# EAGLE design dboard (EAGLE 4.16)
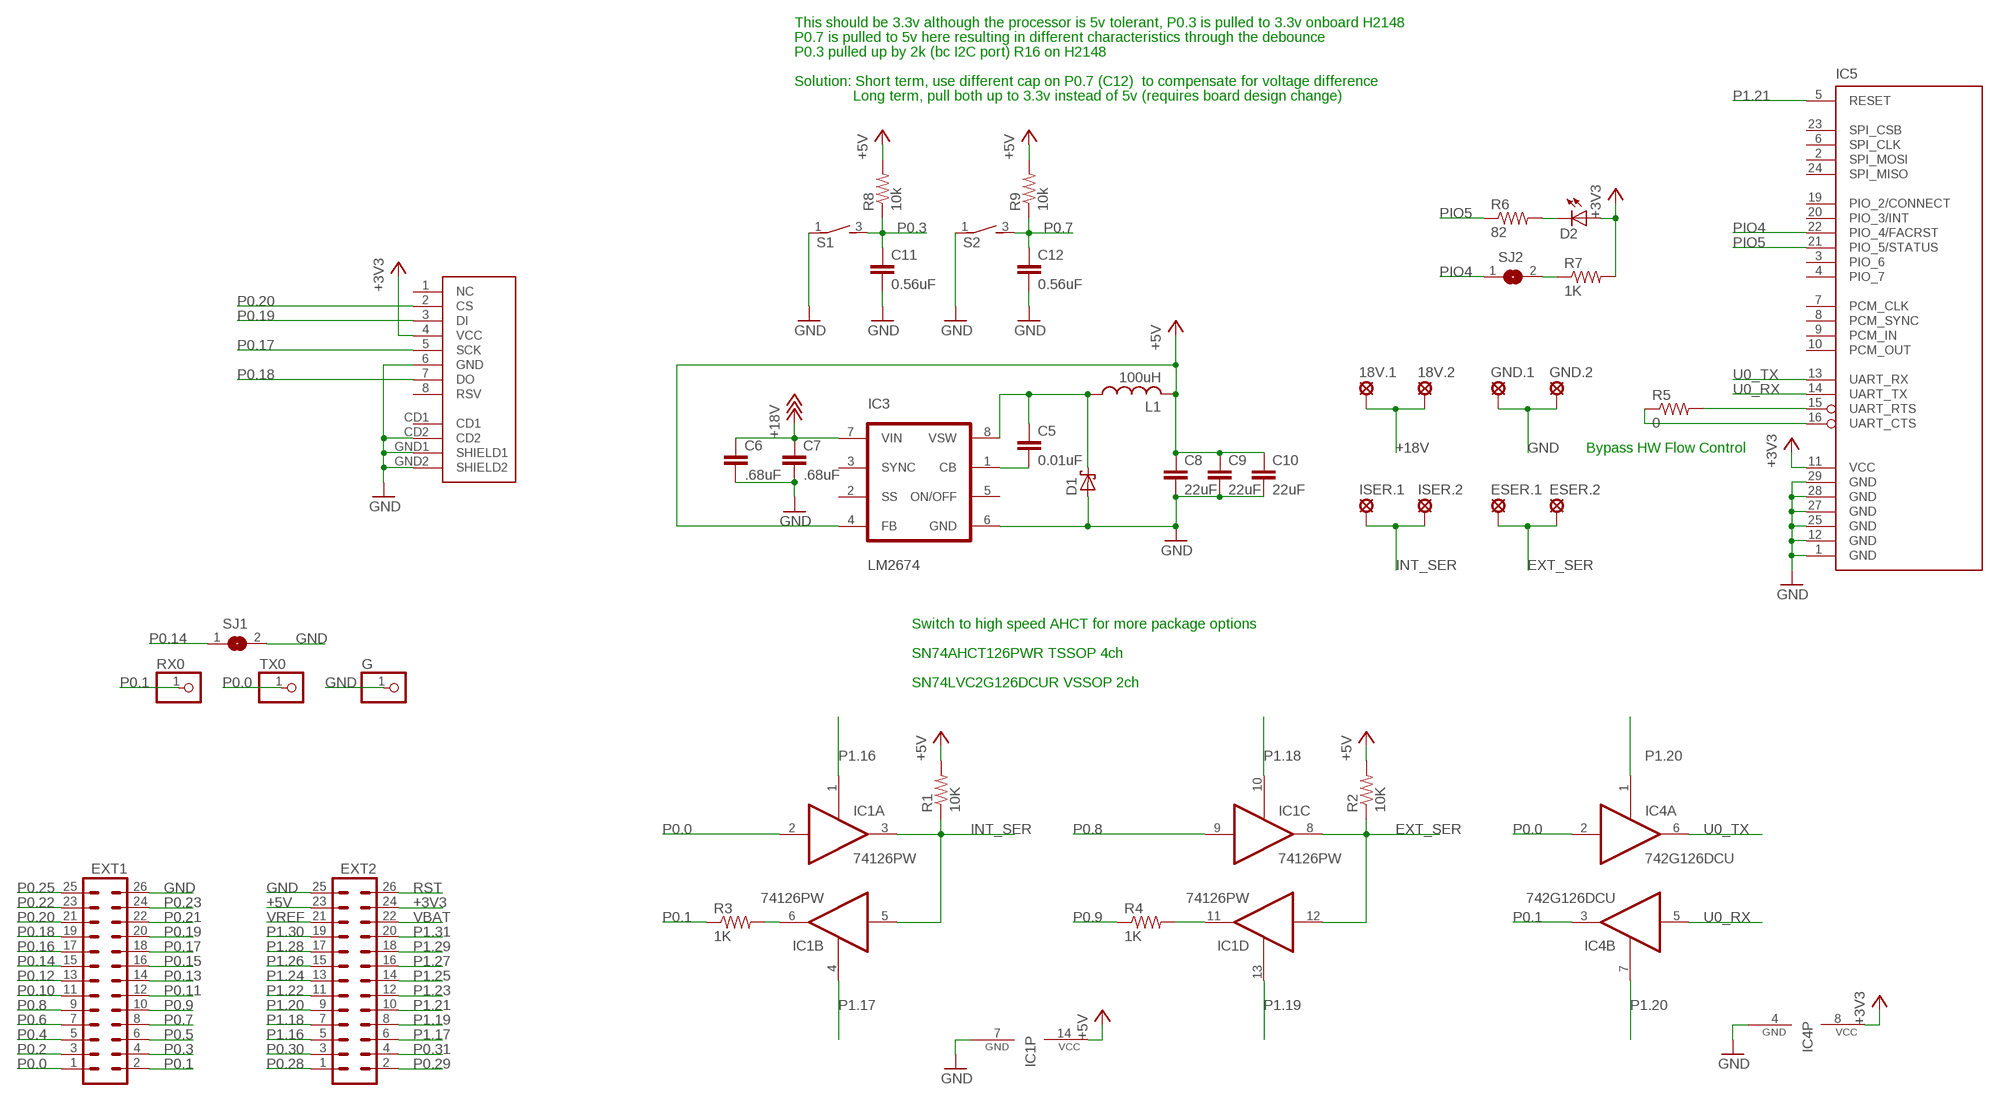
[diagram p0: schematic, sheet 1]

## Parts
18V.1  MCS10B20B  [MCS20B]
18V.2  MCS10B20B  [MCS20B]
C5  0.01uF  C-EUC0603K  [C0603K]
C6  .68uF  C-EUC1210  [C1210]
C7  .68uF  C-EUC1210  [C1210]
C8  22uF  C-EUC1210  [C1210]
C9  22uF  C-EUC1210  [C1210]
C10  22uF  C-EUC1210  [C1210]
C11  0.56uF  C-EUC0603  [C0603]
C12  0.56uF  C-EUC0603  [C0603]
D1  SCHOTTKY-DIODEDO214AA  [DO214AA]
D2  LEDCHIPLED_0603  [CHIPLED_0603]
ESER.1  MCS10B20B  [MCS20B]
ESER.2  MCS10B20B  [MCS20B]
EXT1  ML26ML26R  [ML26R]
EXT2  ML26ML26R  [ML26R]
G  PINHD-1X1  [1X01]
GND.1  MCS10B20B  [MCS20B]
GND.2  MCS10B20B  [MCS20B]
IC1  74126PW  [TSSOP14]
IC3  LM2674  [SO8]
IC4  742G126DCU  [VSSOP8]
IC5  BLUERADIO_BR-C40ABAS  [BLUERADIO_BR-C40A]
ISER.1  MCS10B20B  [MCS20B]
ISER.2  MCS10B20B  [MCS20B]
L1  100uH  L-USDR74  [DR74]
R1  10K  R-US_R0603  [R0603]
R2  10K  R-US_R0603  [R0603]
R3  1K  R-US_R0603  [R0603]
R4  1K  R-US_R0603  [R0603]
R5  0  R-US_R0603  [R0603]
R6  82  R-US_R0603  [R0603]
R7  1K  R-US_R0603  [R0603]
R8  10k  R-US_R0603  [R0603]
R9  10k  R-US_R0603  [R0603]
RX0  PINHD-1X1  [1X01]
S1  GP11MSV1BE  [GP12MSV1BE]
S2  GP11MSV1BE  [GP12MSV1BE]
SJ1  SJ  [SJ]
SJ2  SJ  [SJ]
SKT1  USD-SOCKETUSD  [USD-SOCKET-PP]
TX0  PINHD-1X1  [1X01]

## Nets
+3V3: D2.A EXT2.24 IC4.8(P:VCC) IC5.11(VCC) R7.2 SKT1.4(VCC)
+5V: C8.1 C9.1 C10.1 EXT2.23 IC1.14(P:VCC) IC3.4(FB) L1.P$2 R1.2 R2.2 R8.2 R9.2
+18V: 18V.1.MP 18V.2.MP C6.1 C7.1 IC3.7(VIN)
EXT_SER: ESER.1.MP ESER.2.MP IC1.8(C:O) IC1.12(D:I) R2.1
GND: C6.2 C7.2 C8.2 C9.2 C10.2 C11.2 C12.2 D1.A EXT1.26 EXT2.25 G.1 GND.1.MP GND.2.MP IC1.7(P:GND) IC3.6(GND) IC4.4(P:GND) IC5.1(GND) IC5.12(GND) IC5.25(GND) IC5.27(GND) IC5.28(GND) IC5.29(GND) S1.1(P) S2.1(P) SJ1.2 SKT1.6(GND) SKT1.CD2 SKT1.GND1(SHIELD1) SKT1.GND2(SHIELD2)
INT_SER: IC1.3(A:O) IC1.5(B:I) ISER.1.MP ISER.2.MP R1.1
N$1: C5.2 IC3.1(CB)
N$2: IC1.11(D:O) R4.2
N$3: C5.1 D1.C IC3.8(VSW) L1.P$1
N$4: IC1.6(B:O) R3.2
N$5: IC5.15(UART_RTS) R5.2
N$6: IC5.16(UART_CTS) R5.1
N$7: D2.C R6.2
N$8: R7.1 SJ2.2
P0.0: EXT1.1 IC1.2(A:I) IC4.2(A:I) TX0.1
P0.1: EXT1.2 IC4.3(B:O) R3.1 RX0.1
P0.2: EXT1.3
P0.3: C11.1 EXT1.4 R8.1 S1.3(S)
P0.4: EXT1.5
P0.5: EXT1.6
P0.6: EXT1.7
P0.7: C12.1 EXT1.8 R9.1 S2.3(S)
P0.8: EXT1.9 IC1.9(C:I)
P0.9: EXT1.10 R4.1
P0.10: EXT1.11
P0.11: EXT1.12
P0.12: EXT1.13
P0.13: EXT1.14
P0.14: EXT1.15 SJ1.1
P0.15: EXT1.16
P0.16: EXT1.17
P0.17: EXT1.18 SKT1.5(SCK)
P0.18: EXT1.19 SKT1.7(DO)
P0.19: EXT1.20 SKT1.3(DI)
P0.20: EXT1.21 SKT1.2(CS)
P0.21: EXT1.22
P0.22: EXT1.23
P0.23: EXT1.24
P0.25: EXT1.25
P0.28: EXT2.1
P0.29: EXT2.2
P0.30: EXT2.3
P0.31: EXT2.4
P1.16: EXT2.5 IC1.1(A:OE)
P1.17: EXT2.6 IC1.4(B:OE)
P1.18: EXT2.7 IC1.10(C:OE)
P1.19: EXT2.8 IC1.13(D:OE)
P1.20: EXT2.9 IC4.1(A:OE) IC4.7(B:OE)
P1.21: EXT2.10 IC5.5(RESET)
P1.22: EXT2.11
P1.23: EXT2.12
P1.24: EXT2.13
P1.25: EXT2.14
P1.26: EXT2.15
P1.27: EXT2.16
P1.28: EXT2.17
P1.29: EXT2.18
P1.30: EXT2.19
P1.31: EXT2.20
PIO4: IC5.22(PIO_4/FACRST) SJ2.1
PIO5: IC5.21(PIO_5/STATUS) R6.1
RST: EXT2.26
U0_RX: IC4.5(B:I) IC5.14(UART_TX)
U0_TX: IC4.6(A:O) IC5.13(UART_RX)
VBAT: EXT2.22
VREF: EXT2.21
Unconnected: IC3.2(SS) IC3.3(SYNC) IC3.5(ON/OFF) IC5.2(SPI_MOSI) IC5.3(PIO_6) IC5.4(PIO_7) IC5.6(SPI_CLK) IC5.7(PCM_CLK) IC5.8(PCM_SYNC) IC5.9(PCM_IN) IC5.10(PCM_OUT) IC5.19(PIO_2/CONNECT) IC5.20(PIO_3/INT) IC5.23(SPI_CSB) IC5.24(SPI_MISO) SKT1.1(NC) SKT1.8(RSV) SKT1.CD1

## Notes on the sheet
- This should be 3.3v although the processor is 5v tolerant, P0.3 is pulled to 3.3v onboard H2148
- P0.7 is pulled to 5v here resulting in different characteristics through the debounce
- P0.3 pulled up by 2k (bc I2C port) R16 on H2148
- Solution: Short term, use different cap on P0.7 (C12)  to compensate for voltage difference
- Long term, pull both up to 3.3v instead of 5v (requires board design change)
- Bypass HW Flow Control
- Switch to high speed AHCT for more package options
- SN74AHCT126PWR TSSOP 4ch
- SN74LVC2G126DCUR VSSOP 2ch

## Library data of the parts
18V.1 18V.2 ESER.1 ESER.2 GND.1 GND.2 ISER.1 ISER.2 = solpad:MCS10B: SOLDER PAD MC S1, distributor Buerklin, 15F505
C5-C12 = rcl:C-EU: CAPACITOR, European symbol
D1 = diode:SCHOTTKY-DIODE: Schottky Diode
D2 = led:LED: LED OSRAM: - CHIPLED LG R971, LG N971, LY N971, LG Q971, LY Q971, LO R971, LY R971 LH N974, LH R974 LS Q976, LO Q976, LY Q976 LO Q996 - Hyper CHIPLED LW Q18S LB Q993, LB Q99A, LB R99A - SideLED LS A670, LO A670, LY A670, LG A670, LP A670 LB A673, LV A673, LT A673, LW A673 LH A674 LY A675 LS A676, LA A676, LO A676, LY A676, LW A676 LS A679, LY A679, LG A679 - Hyper Micro SIDELED® LS Y876, LA Y876, LO Y876, LY Y876 LT Y87S - SmartLED LW L88C, LW L88S LB L89C, LB L89S, LG L890 LS L89K, LO L89K, LY L89K LS L896, LA L896, LO L896, LY L896 - TOPLED LS T670, LO T670, LY T670, LG T670, LP T670 LSG T670, LSP T670, LSY T670, LOP T670, LYG T670 LG T671, LOG T671, LSG T671 LB T673, LV T673, LT T673, LW T673 LH T674 LS T676, LA T676, LO T676, LY T676, LB T676, LH T676, LSB T676, LW T676 LB T67C, LV T67C, LT T67C, LS T67K, LO T67K, LY T67K, LW E67C LS E67B, LA E67B, LO E67B, LY E67B, LB E67C, LV E67C, LT E67C LW T67C LS T679, LY T679, LG T679 LS T770, LO T770, LY T770, LG T770, LP T770 LB T773, LV T773, LT T773, LW T773 LH T774 LS E675, LA E675, LY E675, LS T675 LS T776, LA T776, LO T776, LY T776, LB T776 LHGB T686 LT T68C, LB T68C - Hyper Mini TOPLED® LB M676 - Mini TOPLED Santana® LG M470 LS M47K, LO M47K, LY M47K Source: http://www.osram.convergy.de - LUMILED® LXK2-PW12-R00, LXK2-PW12-S00, LXK2-PW14-U00, LXK2-PW14-V00 LXK2-PM12-R00, LXK2-PM12-S00, LXK2-PM14-U00 LXK2-PE12-Q00, LXK2-PE12-R00, LXK2-PE12-S00, LXK2-PE14-T00, LXK2-PE14-U00 LXK2-PB12-K00, LXK2-PB12-L00, LXK2-PB12-M00, LXK2-PB14-N00, LXK2-PB14-P00, LXK2-PB14-Q00 LXK2-PR12-L00, LXK2-PR12-M00, LXK2-PR14-Q00, LXK2-PR14-R00 LXK2-PD12-Q00, LXK2-PD12-R00, LXK2-PD12-S00 LXK2-PH12-R00, LXK2-PH12-S00 LXK2-PL12-P00, LXK2-PL12-Q00, LXK2-PL12-R00 Source: www.luxeon.com
EXT1 EXT2 = con-harting-ml:ML26: HARTING
G RX0 TX0 = pinhead:PINHD-1X1: PIN HEADER
IC1 = 74xx-us:74*126: Quad bus BUFFER, 3-state
IC3 = lm267x:LM2674
IC4 = 74xx-us:74*2G126
IC5 = SparkFunEagle-6-6-07:BLUERADIO_BR-C40A: Bluetooth SMD Module Footprint fully proven. Spark Fun Electronics SKU : WRL-00149
L1 = rcl:L-US: INDUCTOR, American symbol
R1-R9 = rcl:R-US_: RESISTOR, American symbol
S1 S2 = switch:GP11MSV1BE
SJ1 SJ2 = jumper:SJ: SMD solder JUMPER
SKT1 = SparkFunEagle-6-6-07:USD-SOCKET: microSD Socket Push-push type uSD socket. Schematic element and footprint production proven. Spark Fun Electronics SKU : PRT-00127. tDoc lines correctly indicate media card edge positions when inserting (unlocked, locked, depressed).

## Board
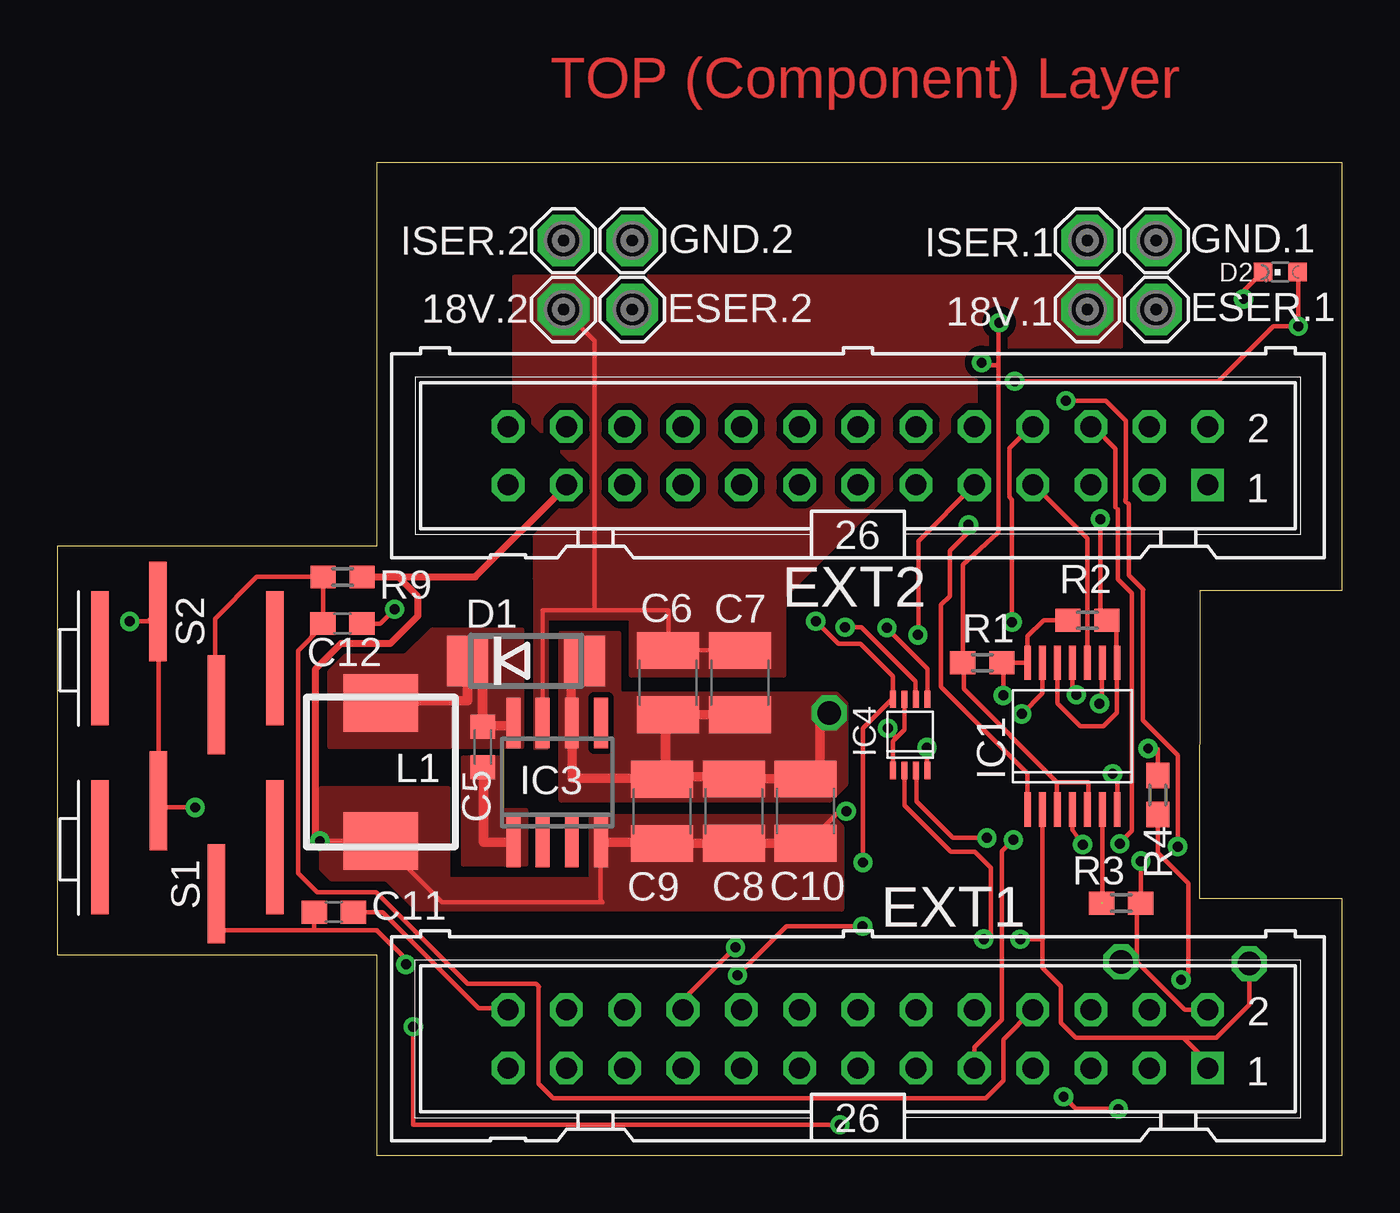
[diagram p1: board, top side]
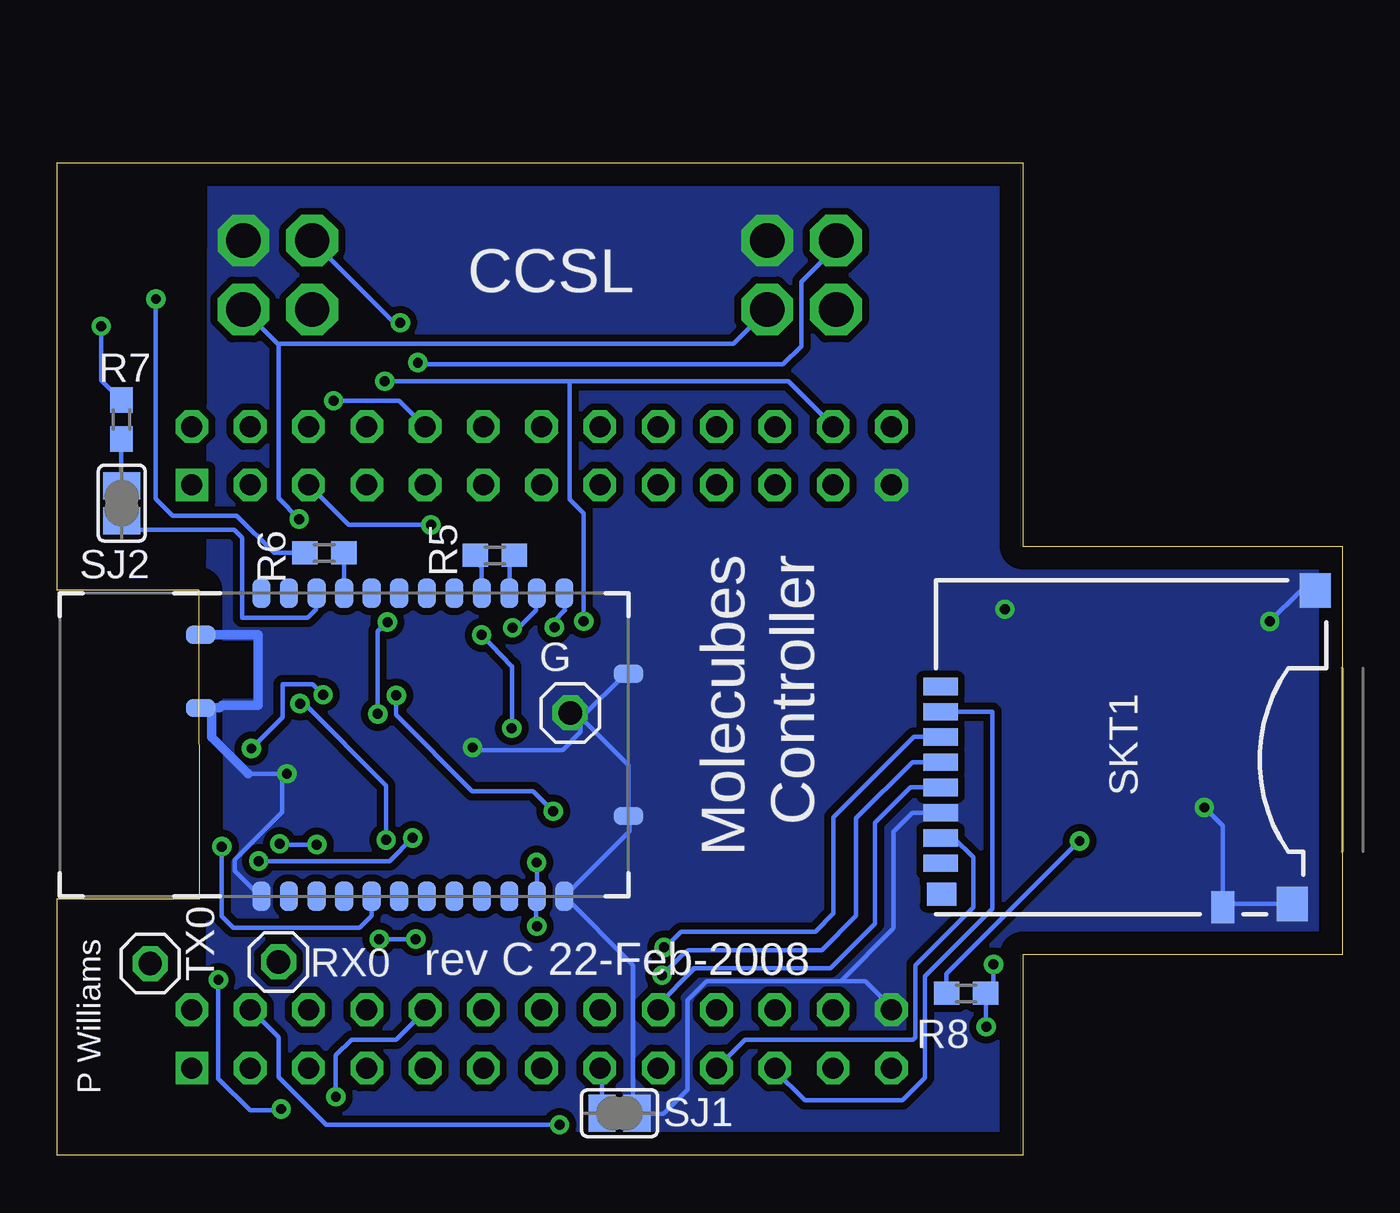
[diagram p2: board, bottom side, seen from below]

Size 55.98 x 43.23 mm. Coordinates in mm from the lower left corner, seen from the top.
Outline: 0,8.73 13.92,8.73 13.92,0 55.98,0 55.98,11.18 49.79,11.18 49.8,24.61 55.98,24.61 55.98,43.23 13.92,43.23 13.92,26.54 0,26.54 0,8.73
Copper layers (1*16): Top 0.035mm / dielectric 1.5mm / Bottom 0.035mm
Design rules "default": minimum track width 7mil, minimum drill 17mil, track to track 7mil, track to pad 7mil, pad to pad 7mil, via to via 7mil, smd to smd 8mil, copper to edge 40mil, drill to drill 8mil, minimum pad ring 10mil, minimum via ring 8mil, stop-mask expansion 4mil, vias tented up to drill 0mil, thermal gap 10mil

### Footprints (pad centres in the part's own frame; a part is rotated, then mirrored left to right if it is on the bottom)
MCS20B = drill 1.5 pad 2.159 octagon: MP 0,0
C0603K = smd 1.05 x 1.08: 1 -0.875,0; 2 0.875,0
C1210 = smd 1.6 x 2.7: 1 -1.4,0; 2 1.4,0
C0603 = smd 1.1 x 1: 1 -0.85,0; 2 0.85,0
DO214AA = smd 1.8 x 2.2: A 2.55,0; C -2.55,0
CHIPLED_0603 = smd 0.8 x 0.8: A 0,-0.75; C 0,0.75
ML26R = drill 0.914 square: 1 15.24,-1.27 | drill 0.914 octagon: 2 15.24,1.27; 3 12.7,-1.27; 4 12.7,1.27; 5 10.16,-1.27; 6 10.16,1.27; 7 7.62,-1.27; 8 7.62,1.27; 9 5.08,-1.27; 10 5.08,1.27; 11 2.54,-1.27; 12 2.54,1.27; 13 0,-1.27; 14 0,1.27; 15 -2.54,-1.27; 16 -2.54,1.27; 17 -5.08,-1.27; 18 -5.08,1.27; 19 -7.62,-1.27; 20 -7.62,1.27; 21 -10.16,-1.27; 22 -10.16,1.27; 23 -12.7,-1.27; 24 -12.7,1.27; 25 -15.24,-1.27; 26 -15.24,1.27
1X01 = drill 1.016 octagon: 1 0,0
TSSOP14 = smd 0.3 x 1.5: 1 -1.95,-3.2; 2 -1.3,-3.2; 3 -0.65,-3.2; 4 0,-3.2; 5 0.65,-3.2; 6 1.3,-3.2; 7 1.95,-3.2; 8 1.95,3.2; 9 1.3,3.2; 10 0.65,3.2; 11 0,3.2; 12 -0.65,3.2; 13 -1.3,3.2; 14 -1.95,3.2
SO8 = smd 0.6 x 2.2: 1 -1.905,-2.6; 2 -0.635,-2.6; 3 0.635,-2.6; 4 1.905,-2.6; 5 1.905,2.6; 6 0.635,2.6; 7 -0.635,2.6; 8 -1.905,2.6
VSSOP8 = smd 0.25 x 0.75: 1 -0.75,-1.55; 2 -0.25,-1.55; 3 0.25,-1.55; 4 0.75,-1.55; 5 0.75,1.55; 6 0.25,1.55; 7 -0.25,1.55; 8 -0.75,1.55
BLUERADIO_BR-C40A = smd 0.8 x 1.3: 1 -6.6,-6.6; 2 -5.4,-6.6; 3 -4.2,-6.6; 4 -3,-6.6; 5 -1.8,-6.6; 6 -0.6,-6.6; 7 0.6,-6.6; 8 1.8,-6.6; 9 3,-6.6; 10 4.2,-6.6; 11 5.4,-6.6; 12 6.6,-6.6; 13 6.6,6.6; 14 5.4,6.6; 15 4.2,6.6; 16 3,6.6; 17 1.8,6.6; 18 0.6,6.6; 19 -0.6,6.6; 20 -1.8,6.6; 21 -3,6.6; 22 -4.2,6.6; 23 -5.4,6.6; 24 -6.6,6.6 | smd 1.3 x 0.8: 25 -9.25,4.8; 27 -9.25,1.6; 28 9.4,3.1; 29 9.4,-3.1
DR74 = smd 2.5 x 3.25: P$1 -3,0; P$2 3,0
R0603 = smd 1.1 x 1: 1 -0.85,0; 2 0.85,0
GP12MSV1BE = smd 4.318 x 0.762: 1 -2.032,-1.27; 3 2.032,1.27 | smd 5.842 x 0.762: S1 0,3.81; S2 0,-3.81
SJ = smd 1.168 x 1.6: 1 -0.762,0; 2 0.762,0
USD-SOCKET-PP = smd 0.75 x 1.5: 1 3.2,16.8; 2 2.1,16.8; 3 1,16.8; 4 -0.1,16.8; 5 -1.2,16.8; 6 -2.3,16.8; 7 -3.4,16.8; 8 -4.5,16.8 | smd 1 x 1.3: CD1 -5.85,16.75 | smd 1.4 x 1: CD2 -6.425,4.5 | smd 1.5 x 1.35: GND1 -6.275,1.475; GND2 7.375,0.475

### Placement (x,y rotation side)
18V.1  44.88,36.84 0 top
18V.2  22.05,36.84 0 top
C5  18.54,17.78 270 top
C6  26.6,20.58 270 top
C7  29.75,20.59 270 top
C8  29.48,14.99 90 top
C9  26.35,14.98 90 top
C10  32.59,14.99 90 top
C11  12.05,10.58 0 top
C12  12.42,23.16 0 top
D1  20.42,21.54 0 top
D2  53.29,38.47 90 top
ESER.1  47.88,36.84 0 top
ESER.2  25.05,36.84 0 top
EXT1  34.88,5.07 0 top
EXT2  34.88,30.47 0 top
G  33.64,19.27 0 bottom
GND.1  47.88,39.84 0 top
GND.2  25.05,39.84 0 top
IC1  44.23,18.25 0 top
IC3  21.78,16.24 0 top
IC4  37.16,18.31 0 top
IC5  40.49,17.88 0 bottom
ISER.1  44.88,39.84 0 top
ISER.2  22.05,39.84 0 top
L1  14.09,16.69 270 top
R1  40.3,21.45 0 top
R2  44.88,23.31 180 top
R3  46.35,10.99 180 top
R4  47.95,15.69 90 top
R5  36.92,26.13 0 bottom
R6  44.35,26.24 180 bottom
R7  53.19,32.05 90 bottom
R8  16.38,7.05 180 bottom
R9  12.43,25.19 0 top
RX0  46.35,8.42 0 bottom
S1  5.67,13.42 270 top
S2  5.66,21.65 270 top
SJ1  31.49,1.83 0 bottom
SJ2  53.18,28.41 90 bottom
SKT1  0.7,17.22 90 bottom
TX0  51.94,8.35 0 bottom

### Tracks (layer width: path | path; a pad name or v marks a point on that pad's centre or on a via)
+3V3  (via drill 0.43)
  Top 0.203: v41.71,33.72 50.58,33.72 | 50.58,33.72 50.57,33.71 | 50.58,33.72 | 50.58,33.72 52.97,36.11 v54.07,36.11 54.07,38.47 | 54.07,38.47 54.06,38.47 D2.A | 54.07,38.47 | v29.64,7.84 31.78,9.98 v35.09,9.98 | v35.1,12.75 35.1,18.61 36.4,19.91 36.41,19.91 IC4.8 36.41,20.86 34.98,22.29 34.03,22.29 33.45,22.87 | 33.45,22.87 | 33.45,22.87 v33.05,23.27
  Bottom 0.203: R7.2 53.2,32.9 54.07,33.76 v54.07,36.11 | EXT2.24 22.16,31.76 24.12,33.72 33.66,33.72 | 33.66,33.72 v41.71,33.72 | v29.64,7.84 28.72,8.76 28.72,8.74 28.71,8.73 28.5,8.94 22.66,8.94 21.18,10.43 21.18,14.67 18.73,17.12 SKT1.4 | 35.12,11.31 35.12,11.36 | 35.12,11.31 IC5.11 35.09,12.74 v35.1,12.75 | v35.09,9.98 35.12,10.01 35.12,11.31 | v33.05,23.27 33.05,27.96 33.66,28.57 33.66,33.72 | 33.66,33.72
+5V  (via drill 0.43)
  Top 0.203: IC3.4 23.68,13.63 23.68,11.1 23.75,11.03 16.76,11.03 L1.P$2 14.07,13.69 13.98,13.61 13.9,13.69 v11.44,13.69 v11.43,13.69 11.26,13.86 | 22.18,29.16 EXT2.23 | R2.2 42.98,23.31 42.28,22.6 42.28,21.49 IC1.14 41.07,21.45 | 41.07,21.45 R1.2 41.16,21.46 41.21,21.46 v41.21,20.03 | 41.07,21.45 41,21.52 | 32.67,13.59 34.07,14.99 v34.37,14.99 | 14.85,25.19 R9.2
  Top 0.305: R9.2 18.21,25.19 22.18,29.16 | 14.85,25.19 15.71,24.32 15.71,23.5 14.52,22.3 12.36,22.3 11.26,21.2 11.26,13.86
  Top 0.406: 29.3,13.58 29.3,13.59 C8.1 32.67,13.59 | 29.3,13.58 C9.1 26.37,13.58 | 29.3,13.58 29.3,13.49 | 32.67,13.59 C10.1 | 32.67,13.59 32.67,13.4 | 26.37,13.58 26.37,13.45 | IC3.4 26.37,13.64 26.37,13.58
  Bottom 0.203: R8.2 17.23,7.9 v11.44,13.69 | v34.37,14.99 35.25,15.87 37.9,15.87 41.21,19.18 v41.21,20.03
  pour Top (isolate 0.254, no thermals): 24.75,14.77 33.73,14.77 34.19,14.31 34.19,10.72 15.65,10.72 14.35,12.02 11.95,12.02 11.49,12.48 11.49,15.99 17.03,15.99 17.03,12.02 23.26,12.02 23.26,14.77 24.83,14.77
+18V
  Top 0.203: IC3.7 21.15,23.73 23.41,23.73 | 23.41,23.73 26.63,23.73 26.63,21.99 | 26.63,21.97 26.6,21.97 C6.1 26.63,21.99 | 26.63,21.99 26.63,21.97 | 26.63,21.97 26.65,21.97 | C7.1 26.63,21.99 | 18V.2.MP 23.41,35.49 23.41,23.73
  pour Top (isolate 0.305, no thermals): 21.32,17.74 21.32,23.38 24.99,23.38 24.99,20.91 31.66,20.91 31.66,24.42 31.68,24.37 40,32.69 40,35.24 46.34,35.24 46.34,35.24 46.34,38.27 19.92,38.27 19.92,32.71 19.92,32.71 23.18,29.46 20.81,26.97 20.83,23.21 20.83,17.74
EXT_SER  (via drill 0.43)
  Top 0.203: 43.58,21.41 43.56,21.41 | 43.58,21.41 IC1.12 | 46.15,23.27 45.77,23.27 R2.1 | IC1.8 46.15,21.48 46.15,23.27 | 43.58,21.41 43.58,19.68 44.57,18.69 45.58,18.69 46.17,19.28 46.17,21.41 46.15,21.43 IC1.8 | IC1.8 | 46.15,23.27 45.44,23.27 v45.44,27.71
  Bottom 0.203: v45.44,27.71 46.34,28.61 46.34,35.33 46.32,35.34 | ESER.1.MP 47.83,36.78 47.83,36.57 | ESER.1.MP 47.88,36.64 | 25.05,36.81 ESER.2.MP 25.05,36.82 26.53,35.34 46.32,35.34 | ESER.1.MP 46.39,35.34 46.32,35.34
GND  (via drill 0.43)
  Top 0.203: S2.1 4.33,23.64 | 4.41,23.7 4.41,23.81 | 4.41,23.7 S2.1 | 4.41,23.7 4.41,15.46 S1.1 4.39,15.32 4.57,15.15 v6,15.15 | C11.2 14.18,10.58 18.35,6.41 19.6,6.41 19.67,6.34 | 19.67,6.34 19.69,6.32 | 19.67,6.34 EXT1.26 | IC4.4 37.89,16.78 v37.89,17.76 | v45.98,16.62 45.98,16.61 46.18,16.42 IC1.7 | C12.2 14.07,23.16 v14.69,23.78 | S2.1 3.96,23.26 v3.16,23.26
  Top 0.406: 29.39,16.39 C8.2 | 29.39,16.39 C10.2 33.23,16.39 33.23,19.09 | 29.39,16.39 29.39,16.49 26.34,16.49 | 26.34,16.49 26.34,16.38 C9.2 26.35,16.42 22.42,16.42 IC3.6 22.39,18.84 22.39,21.78 23.03,21.78 23.03,21.54 D1.A | 26.34,16.49 26.34,16.61 26.5,16.61 26.5,19.18 C6.2 C7.2 | C7.2 | C7.2 | C7.2 29.74,19.03 | 33.23,19.09 33.23,19.1 | G.1 33.23,19.09
  Bottom 0.203: G.1 33.17,19.07 33.15,19.05 31.23,20.98 IC5.28 | v37.89,17.76 37.77,17.65 33.98,17.65 33.18,18.44 33.18,19.08 G.1 | 49.26,19.38 49.36,19.48 IC5.27 49.7,19.48 49.66,19.51 49.64,19.49 | 46.11,16.62 46.11,16.61 | 46.11,16.62 47.67,16.62 | 48.91,19.49 48.8,19.6 | 45.98,16.61 45.99,16.62 46.11,16.62 | 45.98,16.61 v45.98,16.62 v45.97,16.62 | 45.98,16.61 45.98,16.6 | IC5.1 47.15,11.28 48.26,12.39 48.26,12.86 46.19,14.94 46.19,16.41 v45.97,16.62 | v45.97,16.62 45.96,16.63 | 25.06,39.85 25.06,39.86 | GND.2.MP 25.06,39.85 | 25.06,39.85 25.06,39.6 | G.1 33.17,19.09 33.19,19.08 31.09,16.98 IC5.29 31.05,14.77 31.05,14.11 IC5.12 30.89,8.28 30.89,1.75 30.81,1.75 SJ1.2 30.75,1.82 | SKT1.6 18.72,14.92 19.55,14.09 19.55,9.88 21.85,7.59 | 21.85,7.59 27.69,7.59 28.53,6.75 28.53,2.85 29.57,1.82 30.75,1.82 | 30.75,1.82 30.79,1.78 | 19.53,6.34 19.51,6.33 | EXT1.26 19.53,6.34 | 21.85,7.59 20.78,7.59 19.53,6.34 | v6,15.15 5.2,14.35 SKT1.CD2 5.26,10.8 | 5.26,10.8 5.27,10.79 | SKT1.GND1 5.11,10.95 5.26,10.8 | SKT1.GND2 1.81,24.6 v3.16,23.26
  Bottom 0.406: 49.26,19.38 49.26,18.21 47.67,16.62 | 49.64,19.49 48.91,19.49 | 48.8,19.6 47.24,19.6 47.24,22.67 49.72,22.67 49.72,22.68 IC5.25
  pour Top (isolate 0.254, no thermals): 21.95,15.47 33.67,15.47 34.36,16.16 34.36,19.69 33.94,20.11 24.47,20.11 24.47,22.74 21.92,22.74 21.92,15.49
  pour Bottom (isolate 0.305, no thermals): 0.33,9.1 14.38,9.13 14.38,0.33 49.44,0.33 49.41,11.21 49.41,19.8 47.34,19.8 47.34,22.49 49.41,22.49 49.35,42.91 14.38,42.9 14.38,26.06 0.37,26.06 0.34,10.51
INT_SER  (via drill 0.43)
  Top 0.203: 44.89,39.85 ISER.1.MP | IC1.5 44.91,15.05 44.91,16.26 43.56,16.26 | 43.56,15.05 43.56,15.02 | IC1.3 43.56,15.05 | 43.56,15.05 43.56,16.26 | 43.56,16.26 39.49,20.32 39.49,21.46 39.46,21.46 R1.1 39.45,25.72 41,27.14 41,34.39 | 41,34.39 41,34.93 | 41,34.39 40.99,34.39 40.98,34.38 | 41,34.39 41,34.4 41,34.41 40.43,34.41 v40.27,34.53 | 41,34.93 40.99,34.93 40.99,35.45 | 41,34.93 41,34.95 | 40.99,35.45 40.99,35.47 | v41.04,36.26 40.99,36.22 40.99,35.45
  Bottom 0.203: 44.89,39.89 44.88,39.89 ISER.1.MP 41.3,36.26 v41.04,36.26 | ISER.2.MP 22.05,39.56 23.57,38.04 23.57,35.24 24.36,34.45 40.37,34.45 v40.27,34.53
N$1
  Top 0.406: C5.2 18.57,16.91 18.57,13.64 IC3.1
  pour Top (isolate 0.254, no thermals): 20.42,12.67 17.68,12.67 17.68,17.32 19.37,17.32 19.37,15.02 20.42,15.02
N$2  (via drill 0.43)
  Top 0.203: 44.22,21.37 44.23,21.38 IC1.11 44.23,20.23 v44.41,20.06 | R4.2 47.94,17.68 v47.53,17.72
  Bottom 0.203: 44.37,20.38 v44.41,20.06 44.41,20.07 44.86,20.52 46.17,20.52 46.17,19.08 v47.53,17.72
N$3
  Top 0.406: 18.54,18.7 18.52,18.7 | 18.54,18.7 C5.1 18.54,21.49 17.87,21.49 D1.C 17.87,19.79 14.09,19.79 | IC3.8 19.88,18.7 18.54,18.7 | 14.09,19.79 14.01,19.79 | L1.P$1 14.09,19.79
  pour Top (isolate 0.254, no thermals): 20.24,17.8 11.87,17.8 11.87,21.07 12.56,21.76 15.18,21.76 16.32,22.9 20.24,22.9
N$4  (1 unrouted)
  Top 0.203: 45.53,10.99 45.52,10.98 | 45.52,10.99 45.52,10.98 | R3.2 45.52,10.99 | IC1.6 45.52,10.99
N$5
  Bottom 0.203: R5.2 36.07,26.03 36.03,25.99 36.29,25.73 IC5.15
N$6
  Bottom 0.203: R5.1 37.89,26.01 37.49,25.61 IC5.16
N$7  (via drill 0.43)
  Top 0.203: D2.C 52.51,38.47 51.68,37.64 v51.68,37.3
  Bottom 0.203: R6.2 46.53,26.24 48.16,27.87 50.97,27.87 51.7,28.6 v51.7,37.3 v51.69,37.3 v51.68,37.3
N$8
  Bottom 0.203: SJ2.2 53.14,29.13 | SJ2.2 | R7.1 SJ2.2
P0.0  (via drill 0.43)
  Top 0.203: 42.93,9.42 42.93,8.17 43.72,7.37 43.72,5.77 44.38,5.11 49.07,5.11 | 42.93,9.42 IC1.2 | EXT1.1 50.35,3.8 50.36,3.82 49.07,5.11 | IC4.2 36.91,15.25 38.94,13.22 39.99,13.22 40.69,12.52 40.69,9.61 v40.37,9.42 | 42.93,9.42 42.95,9.42 42.93,9.41 v41.96,9.41 | 49.07,5.11 50.5,5.11 51.95,6.56 51.95,8.34 TX0.1 | TX0.1 51.87,8.41 | TX0.1
  Bottom 0.203: v40.37,9.42 v41.96,9.41
P0.1  (via drill 0.43)
  Top 0.203: 50.17,6.34 50.18,6.33 | 50.17,6.34 EXT1.2 | RX0.1 46.38,8.42 46.4,8.44 46.42,8.43 47.04,8.43 | 50.17,6.34 49.12,6.34 47.04,8.43 | 47.2,10.96 47.26,10.96 | 47.2,10.96 R3.1 v47.2,12.81 v47.21,12.81 | 47.04,8.43 47.04,10.96 47.2,10.96 | v40.5,13.82 39.01,13.82 37.42,15.41 37.42,16.74 IC4.3 | IC4.3 37.4,16.77 | IC4.3
  Bottom 0.203: v47.21,12.81 41.51,12.81 v40.5,13.82
P0.3  (via drill 0.43)
  Top 0.203: 6.92,9.85 6.91,9.87 6.91,11.4 6.92,11.4 S1.3 6.93,9.79 11.19,9.79 11.19,10.6 11.2,10.6 C11.1 11.19,10.57 11.19,9.79 13.93,9.79 | v15.51,5.59 15.51,1.33 v34.1,1.33 | 13.93,9.79 15.19,8.53 v15.19,8.32 | 13.93,9.79
  Bottom 0.203: v15.51,5.59 15.53,5.59 R8.1 15.44,7.05 15.42,7.03 15.21,7.25 15.21,8.33 15.2,8.33 v15.19,8.32 | v34.1,1.33 44.28,1.33 46.35,3.4 46.35,5.15 47.56,6.36 EXT1.4
P0.7
  Top 0.203: R9.1 8.69,25.19 6.88,23.38 6.88,19.8 6.86,19.78 6.93,19.71 S2.3 | R9.1 11.58,25.16 11.55,25.13 11.57,25.1 C12.1 | R9.1 11.59,23.08 10.48,21.97 10.48,12.29 11.32,11.45 13.88,11.45 17.87,7.46 20.87,7.46 20.97,7.35 | 20.97,7.35 20.99,7.34 | EXT1.8 42.51,6.34 41.21,5.04 41.21,3.24 40.46,2.48 22.04,2.48 21.6,2.48 20.96,3.12 20.96,7.34 | 20.96,7.34 | 20.97,7.35 20.96,7.34
P0.8  (via drill 0.43)
  Top 0.203: EXT1.9 39.96,4.7 41.16,5.9 41.16,13.24 v41.66,13.74 | IC1.9 | IC1.9 45.51,21.44 45.51,19.78 v45.41,19.67
  Bottom 0.203: v41.66,13.74 41.66,16.1 45.23,19.68 v45.41,19.67
P0.9  (via drill 0.43)
  Top 0.203: R4.1 47.95,13.19 49.27,11.86 49.27,7.95 v48.96,7.64 | v46.23,2.02 44.38,2.02 v43.85,2.55
  Bottom 0.203: v48.96,7.64 48.96,3.34 47.59,1.96 46.29,1.96 v46.23,2.02 | v43.85,2.55 43.85,4.35 43.16,5.04 41.22,5.04 39.92,6.34 | 39.92,6.34 39.89,6.37 | EXT1.10 39.92,6.34
P0.14
  Bottom 0.203: EXT1.15 32.33,3.8 32.25,3.72 SJ1.1
P0.17
  Bottom 0.203: 29.82,6.32 29.82,6.3 | 29.82,6.32 EXT1.18 | 28.26,8.1 29.82,6.54 29.82,6.32 | 28.26,8.1 28.23,8.13 | SKT1.5 | SKT1.5 17.45,15.98 | SKT1.5 18.82,16.02 20.36,14.49 20.36,10.08 22.29,8.14 28.26,8.14 28.29,8.12 28.27,8.1 28.26,8.1
P0.18
  Bottom 0.203: EXT1.19 26.02,5.04 18.71,5.04 18.59,5.15 18.59,8.29 16.08,10.81 16.08,12.97 16.92,13.81 17.51,13.81 | 17.51,13.81 | 17.51,13.81 SKT1.7
P0.19  (via drill 0.43)
  Top 0.203: EXT1.20 | EXT1.20 | v29.55,9.06 27.27,6.77 EXT1.20
  Bottom 0.203: 29.27,9.33 v29.55,9.06 29.52,9.06 29.51,9.05 28.82,9.74 22.96,9.74 22.16,10.53 22.16,14.72 18.66,18.22 SKT1.3
P0.20
  Bottom 0.203: 24.72,3.73 EXT1.21 24.72,3.73 24.74,3.71 23.41,2.39 19.17,2.39 18.17,3.38 18.17,7.8 15.24,10.74 15.24,19.32 SKT1.2
P1.16  (via drill 0.43)
  Top 0.203: IC1.1 42.28,16.63 38.51,20.4 38.51,23.97 38.89,24.36 38.89,26.34 39.69,27.13 39.69,27.45 v39.7,27.46
  Bottom 0.203: EXT2.5 45.02,29.2 43.28,27.46 v39.7,27.46
P1.17  (via drill 0.43)
  Top 0.203: IC1.4 44.23,14.19 v44.68,13.53 | v46.29,13.56 46.24,13.57 46.81,14.14 46.81,24.48 46.2,25.1 46.2,28.14 46.1,28.24 46.1,28.34 | EXT2.6 | EXT2.6 | EXT2.6 45.05,31.73 45.16,31.73 46.1,30.78 46.1,28.34 | 46.1,28.34 46.1,28.35
  Bottom 0.203: v44.68,13.53 46.22,13.52 v46.29,13.56
P1.18
  Top 0.203: 42.56,29.2 EXT2.7 42.53,29.22 44.88,26.88 IC1.10
P1.19  (via drill 0.43)
  Top 0.203: 42.46,31.71 42.46,31.78 EXT2.8 42.45,31.78 41.48,30.8 41.48,28.68 41.6,28.56 v41.6,23.23 | IC1.13 42.93,20.13 v42.02,19.22 | v42.02,19.22 v42.01,19.22 | v42.02,19.23 v42.02,19.22
  Bottom 0.203: 41.93,22.89 v41.6,23.23 41.6,23.24 | 41.6,23.24 41.6,23.25 | v42.02,19.23 42.02,22.82 41.6,23.24
P1.20  (via drill 0.43)
  Top 0.203: IC4.1 36.41,18.03 36.55,18.17 | 36.55,18.17 36.92,18.54 36.92,19.84 IC4.7 | IC4.7 36.89,19.87 | IC4.7 | 36.55,18.17 36.54,18.18 v36.18,18.6 | 37.51,22.65 37.51,22.64 | v37.49,22.67 37.51,22.65 | EXT2.9 37.51,26.75 37.51,22.65
  Bottom 0.203: v37.49,22.67 36.18,21.3 36.18,21.28 36.18,21.29 | 36.18,21.29 | v36.18,18.6 v36.18,18.61 36.18,21.29
P1.21  (via drill 0.43)
  Top 0.203: v43.95,32.87 45.59,32.87 45.68,32.87 46.55,32 46.55,28.57 46.54,28.56 46.54,28.49 46.68,28.35 46.68,25.27 47.31,24.63 47.31,24.64 | v48.81,13.45 48.82,13.26 48.82,17.43 47.31,18.94 47.31,24.63 47.31,24.64 | 47.31,24.64 47.32,24.64
  Bottom 0.203: EXT2.10 41.09,32.87 v43.95,32.87 | v48.81,13.45 48.82,10.4 48.33,9.9 42.82,9.9 42.29,10.44 IC5.5 | IC5.5 42.23,11.34 | IC5.5
PIO4
  Bottom 0.203: SJ2.1 52.78,27.25 48.28,27.25 47.93,26.89 47.93,23.4 45.08,23.4 44.7,23.78 44.7,24.4 44.66,24.44 IC5.22
PIO5
  Bottom 0.203: 43.5,26.28 43.52,26.3 | 43.5,26.28 R6.1 | IC5.21 43.49,26.27 43.5,26.28
U0_RX  (via drill 0.43)
  Top 0.203: v36.15,22.98 36.15,22.95 37.91,21.19 IC4.5
  Bottom 0.203: IC5.14 35.12,24.51 35.12,23.74 | 35.12,23.74 35.88,22.98 v36.15,22.98 | 35.12,23.74 35.12,23.73
U0_TX  (via drill 0.43)
  Top 0.203: v34.32,23.01 35.03,23.01 37.4,20.64 37.4,19.91 37.44,19.87 37.44,19.86 IC4.6
  Bottom 0.203: IC5.13 33.89,23.73 33.87,23.73 | 33.87,23.73 33.87,23.74 | v34.32,23.01 34.32,23.28 33.87,23.73

### Text on the board
Top: TOP (Component) Layer
bNames: CCSL | Controller | Molecubes | P Williams | rev C 22-Feb-2008